# Altium schematic sheet RS485.SchDoc
size 420 x 297 mm; SheetNumber: 20; SheetTotal: 23
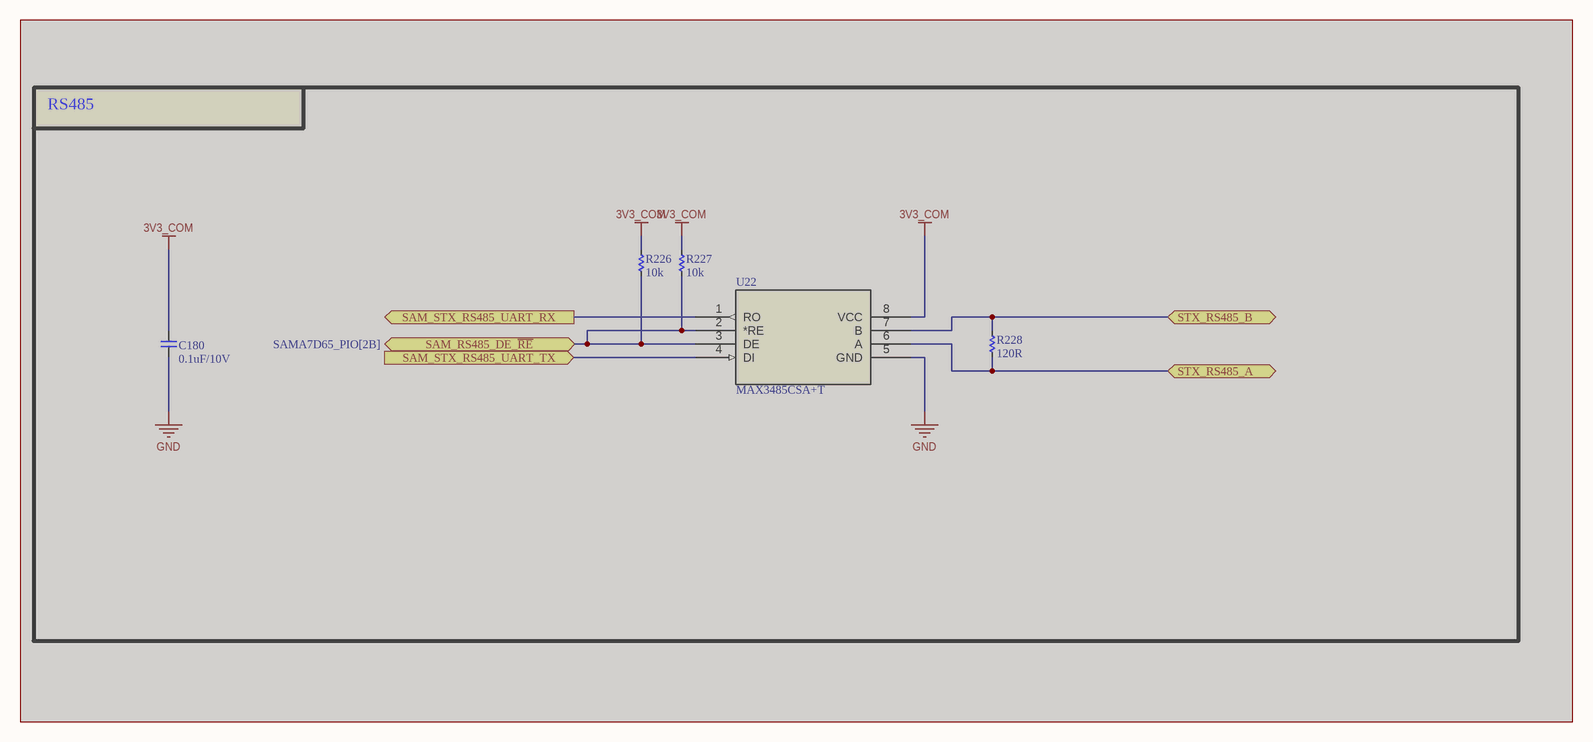
[diagram p0: RS485.SchDoc]

## Parts
C180  0.1uF/10V  [CAP_C_1005X50_L]  (masked out: inside a compile mask, not in the netlist)
R226  10k  [RES_C_1005x30_L]  (masked out: inside a compile mask, not in the netlist)
R227  10k  [RES_C_1005x30_L]  (masked out: inside a compile mask, not in the netlist)
R228  120R  [RES_C_1005x30_L]  (masked out: inside a compile mask, not in the netlist)
U22  MAX3485CSA+T  [21-0041-3-M_90-0096-8L_MXM]  (masked out: inside a compile mask, not in the netlist)

## Blocks framed on the sheet
RS485: C180 R226-R228 U22

## Ports
SAM_RS485_DE_~{RE} (bidir, see SAMA7D65_PIO[2B]), SAM_STX_RS485_UART_RX (out), SAM_STX_RS485_UART_TX (in), STX_RS485_A (bidir), STX_RS485_B (bidir)

## Notes on the sheet
- Project:
- BEE-1012
- Sub-system:
- SATELLITE_EXP_CONTROLLER
- Design by:
- SANG HUYNH
- BAO BUI
- Sheet title:
- Sheet
- A3
- of
- Checked by:
- Approved by:
- VU PHAM
- Revision:
- Document No:
- Size:
- Date:

## Library data of the parts
C180 = _CAP_C_2: CAP CHIP
R226-R228 = _RES_B_2: RES
U22 = MAX3485CSA+T: Low-Power, Slew-Rate-Limited RS-485/RS-422 Transceivers, IC TRANSCEIVER HALF 1/1 8SOIC; Manufacturer_Name: Analog Devices Inc; Manufacturer_Part_Number: MAX485CSA+T; Copyright: Copyright (C) 2025 Ultra Librarian. All rights reserved.; RefDes: RefDes; Type: Type